# EAGLE design PCB_1layer (EAGLE 9.0.1)
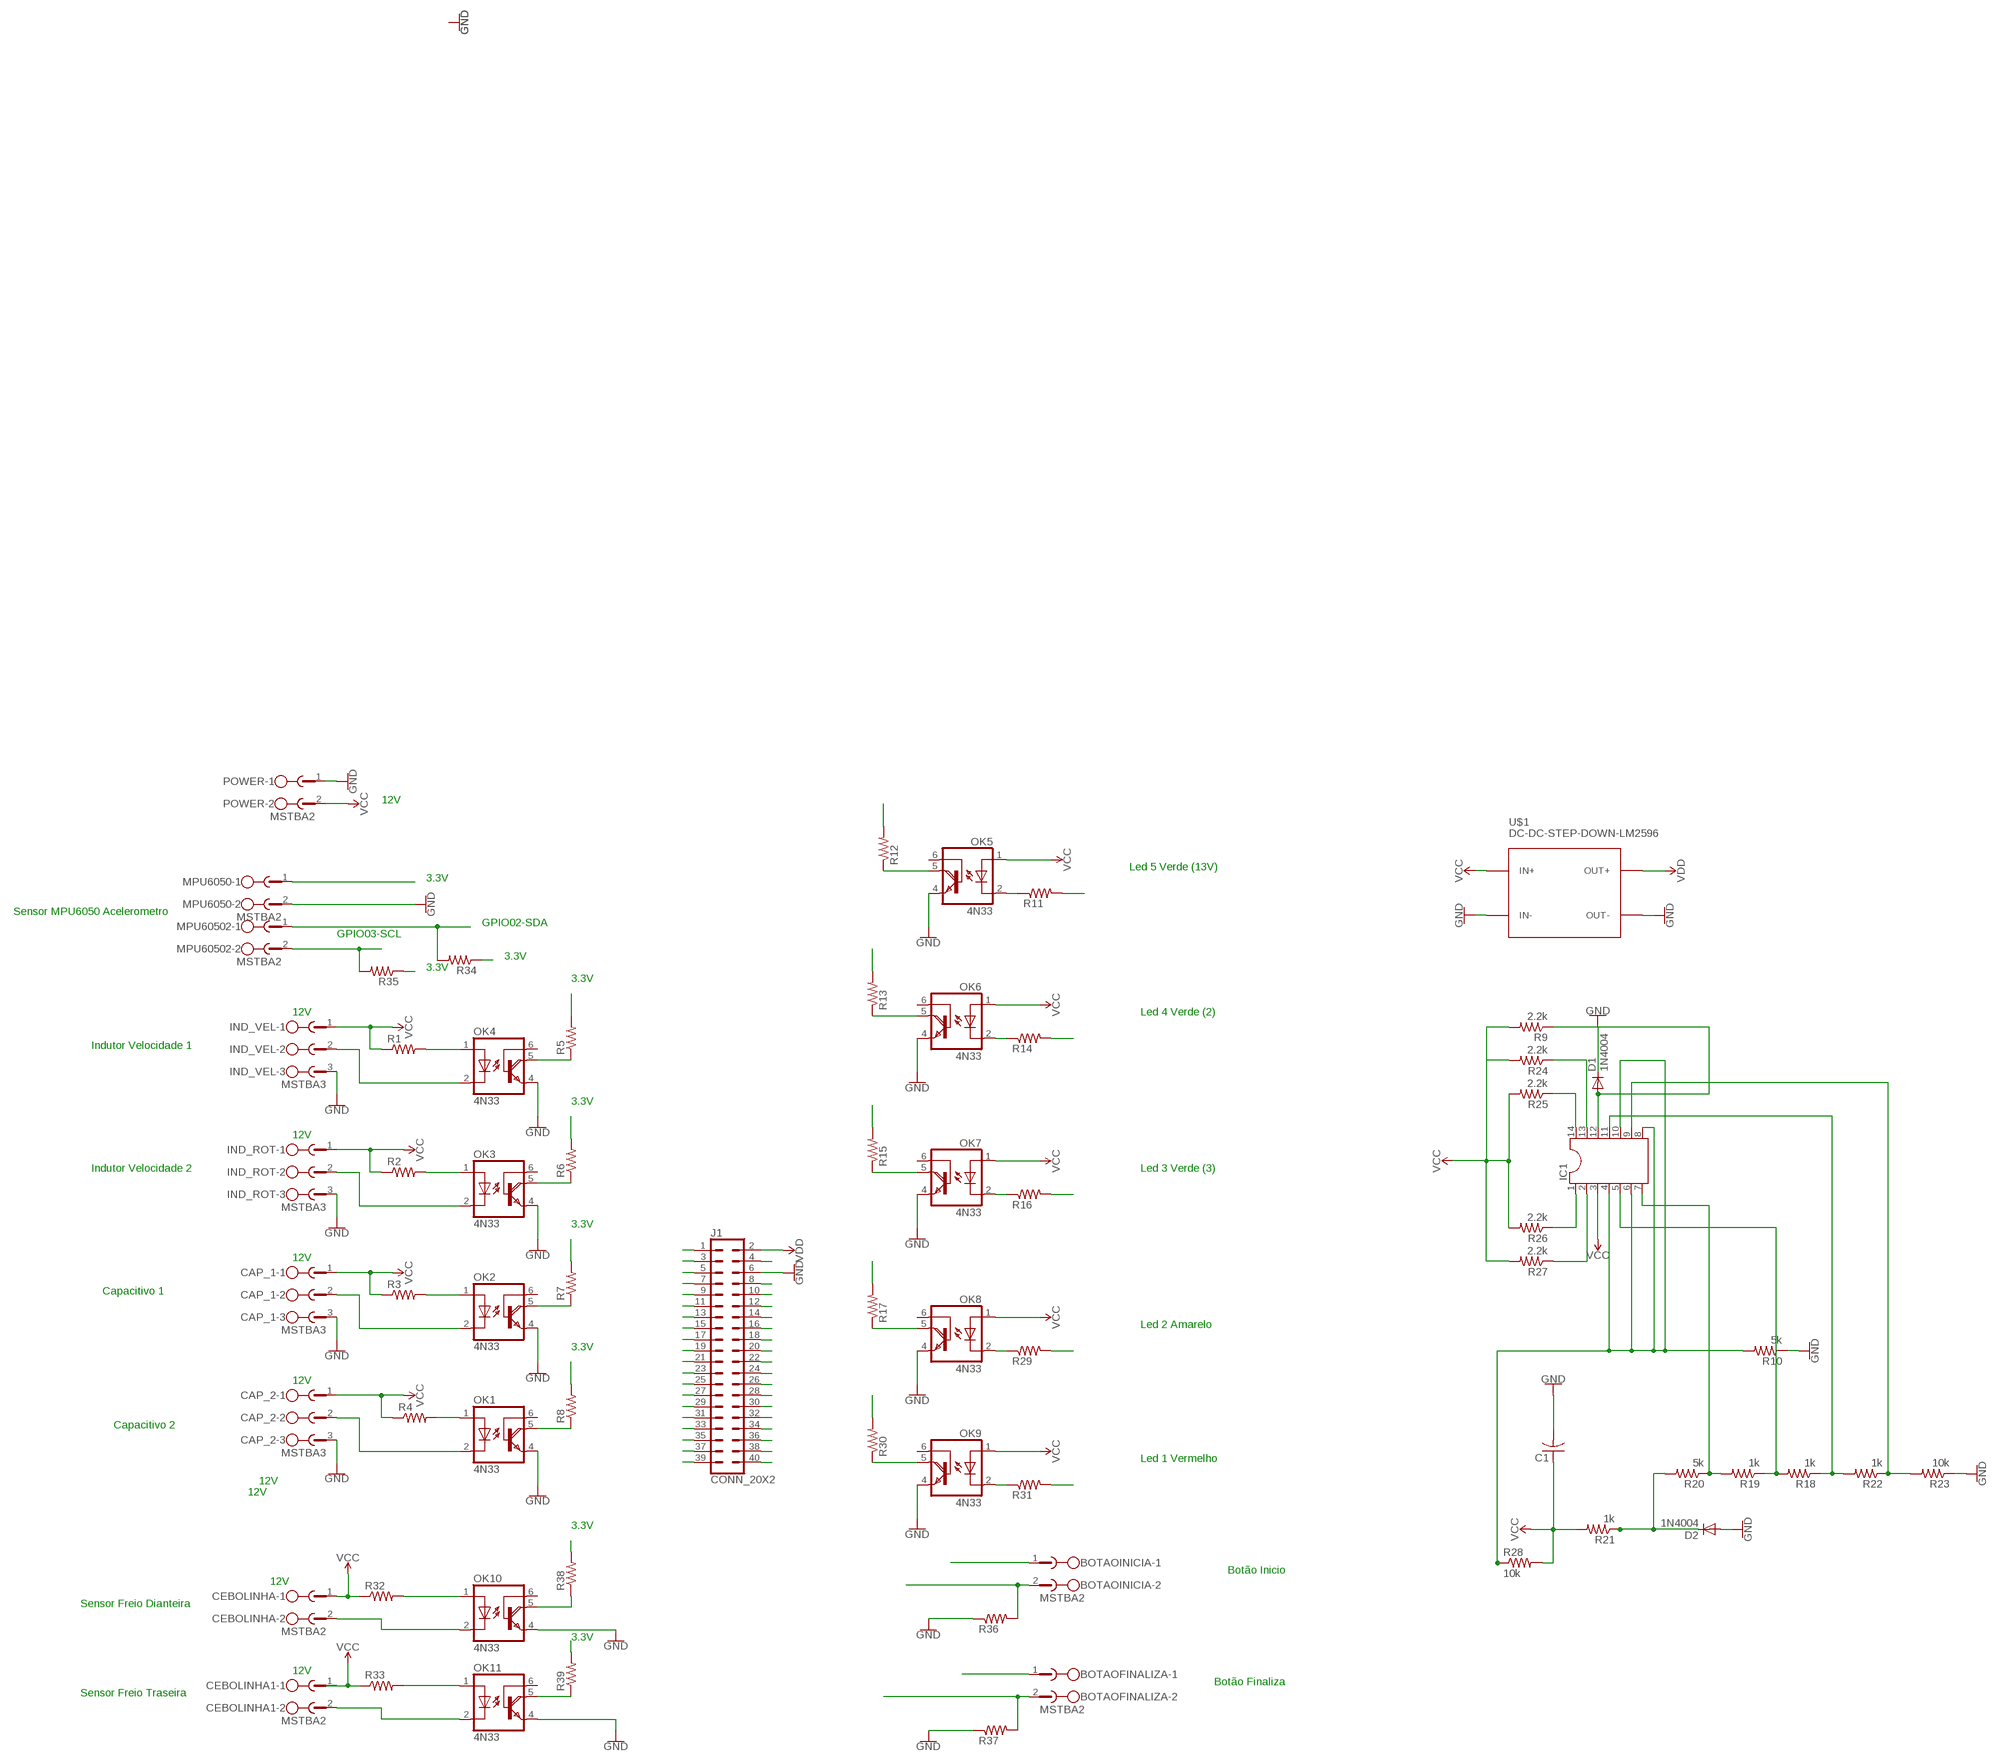
[diagram p0: schematic, sheet 1]

## Parts
BOTAOFINALIZA  MSTBA2  [MSTBA2]
BOTAOINICIA  MSTBA2  [MSTBA2]
C1  C-US025-050X050  [C025-050X050]
CAP_1  MSTBA3  [MSTBA3]
CAP_2  MSTBA3  [MSTBA3]
CEBOLINHA  MSTBA2  [MSTBA2]
CEBOLINHA1  MSTBA2  [MSTBA2]
D1  1N4004  [DO41-10]
D2  1N4004  [DO41-10]
IC1  DIL14  [DIL14]
IND_ROT  MSTBA3  [MSTBA3]
IND_VEL  MSTBA3  [MSTBA3]
J1  CONN_20X2  [2X20]
MPU6050  MSTBA2  [MSTBA2]
MPU60502  MSTBA2  [MSTBA2]
OK1  4N33  [DIL06]
OK2  4N33  [DIL06]
OK3  4N33  [DIL06]
OK4  4N33  [DIL06]
OK5  4N33  [DIL06]
OK6  4N33  [DIL06]
OK7  4N33  [DIL06]
OK8  4N33  [DIL06]
OK9  4N33  [DIL06]
OK10  4N33  [DIL06]
OK11  4N33  [DIL06]
POWER  MSTBA2  [MSTBA2]
R1  R-US_0204/7  [0204/7]
R2  R-US_0204/7  [0204/7]
R3  R-US_0204/7  [0204/7]
R4  R-US_0204/7  [0204/7]
R5  R-US_0204/7  [0204/7]
R6  R-US_0204/7  [0204/7]
R7  R-US_0204/7  [0204/7]
R8  R-US_0204/7  [0204/7]
R9  2.2k  R-US_0207/10  [0207/10]
R10  5k  R-US_0207/10  [0207/10]
R11  R-US_0204/7  [0204/7]
R12  R-US_0204/7  [0204/7]
R13  R-US_0204/7  [0204/7]
R14  R-US_0204/7  [0204/7]
R15  R-US_0204/7  [0204/7]
R16  R-US_0204/7  [0204/7]
R17  R-US_0204/7  [0204/7]
R18  1k  R-US_0207/10  [0207/10]
R19  1k  R-US_0207/10  [0207/10]
R20  5k  R-US_0207/10  [0207/10]
R21  1k  R-US_0207/10  [0207/10]
R22  1k  R-US_0207/10  [0207/10]
R23  10k  R-US_0207/10  [0207/10]
R24  2.2k  R-US_0207/10  [0207/10]
R25  2.2k  R-US_0207/10  [0207/10]
R26  2.2k  R-US_0207/10  [0207/10]
R27  2.2k  R-US_0207/10  [0207/10]
R28  10k  R-US_0207/10  [0207/10]
R29  R-US_0204/7  [0204/7]
R30  R-US_0204/7  [0204/7]
R31  R-US_0204/7  [0204/7]
R32  R-US_0204/7  [0204/7]
R33  R-US_0204/7  [0204/7]
R34  R-US_0204/7  [0204/7]
R35  R-US_0204/7  [0204/7]
R36  R-US_0204/7  [0204/7]
R37  R-US_0204/7  [0204/7]
R38  R-US_0204/7  [0204/7]
R39  R-US_0204/7  [0204/7]
U$1  DC-DC-STEP-DOWN-LM2596  [DC-DC-STEP-DOWN-LM2596]

## Nets
DC3.3V: BOTAOFINALIZA.1 BOTAOINICIA.1 J1.1 J1.17 MPU6050.1 R5.2 R6.2 R7.2 R8.2 R12.2 R13.2 R15.2 R17.2 R30.2 R34.1 R35.1 R38.2 R39.2
GND: C1.2 CAP_1.3 CAP_2.3 D1.C D2.A IND_ROT.3 IND_VEL.3 J1.6 J1.9 J1.14 J1.20 J1.25 J1.30 J1.34 OK1.4(E) OK2.4(E) OK3.4(E) OK4.4(E) OK5.4(E) OK6.4(E) OK7.4(E) OK8.4(E) OK9.4(E) OK10.4(E) OK11.4(E) POWER.1 R10.1 R23.1 R36.1 R37.1 U$1.IN- U$1.OUT-
GPIO01: CEBOLINHA1.2 OK11.2(C)
GPIO02: J1.3
GPIO2: MPU60502.2 R35.2
GPIO03: J1.5 MPU60502.1 R34.2
GPIO04: J1.7 OK4.5(COL) R5.1
GPIO05: J1.29
GPIO06: J1.31
GPIO07: J1.26
GPIO08: J1.24
GPIO09: J1.21
GPIO10: J1.19 OK1.5(COL) R8.1
GPIO11: CEBOLINHA.2 J1.23 OK10.2(C)
GPIO12: J1.32
GPIO13: J1.33
GPIO14: J1.8 OK5.5(COL) R12.1
GPIO15: J1.10 OK6.5(COL) R13.1
GPIO16: BOTAOINICIA.2 J1.36 R36.2
GPIO17: J1.11 OK3.5(COL) R6.1
GPIO18: J1.12 OK7.5(COL) R15.1
GPIO19: J1.35 OK10.5(COL) R38.1
GPIO20: BOTAOFINALIZA.2 J1.38 R37.2
GPIO21: J1.40
GPIO22: J1.15 OK2.5(COL) R7.1
GPIO23: J1.16 OK8.5(COL) R17.1
GPIO24: J1.18 OK9.5(COL) R30.1
GPIO25: J1.22
GPIO26: J1.37 OK11.5(COL) R39.1
GPIO27: J1.13
ID_SC: J1.28
ID_SD: J1.27
LM339P1: IC1.1 R11.2 R26.1
LM339P2: IC1.2 R14.2 R27.1
LM339P12: R31.2
LM339P13: IC1.13 R16.2 R24.1
LM339P14: IC1.14 R25.1 R29.2
LM33912: D1.A IC1.12 R9.1
N$1: IND_ROT.2 OK3.2(C)
N$2: CAP_2.2 OK1.2(C)
N$3: CAP_1.2 OK2.2(C)
N$4: OK3.1(A) R2.2
N$5: OK2.1(A) R3.2
N$6: OK1.1(A) R4.2
N$7: OK4.1(A) R1.2
N$8: IND_VEL.2 OK4.2(C)
N$13: D2.C R20.2 R21.1
N$14: IC1.9 R22.1 R23.2
N$15: IC1.4 IC1.6 IC1.8 IC1.10 R10.2 R28.1
N$16: IC1.5 R18.2 R19.1
N$17: IC1.11 R18.1 R22.2
N$18: IC1.7 R19.2 R20.1
N$22: J1.39
N$24: OK5.2(C) R11.1
N$27: OK6.2(C) R14.1
N$28: OK10.1(A) R32.2
N$29: OK7.2(C) R16.1
N$31: OK8.2(C) R29.1
N$33: OK9.2(C) R31.1
N$34: OK11.1(A) R33.2
VCC: C1.1 CAP_1.1 CAP_2.1 CEBOLINHA1.1 CEBOLINHA.1 IC1.3 IND_ROT.1 IND_VEL.1 OK5.1(A) OK6.1(A) OK7.1(A) OK8.1(A) OK9.1(A) POWER.2 R1.1 R2.1 R3.1 R4.1 R9.2 R21.2 R24.2 R25.2 R26.2 R27.2 R28.2 R32.1 R33.1 U$1.IN+
VDD: J1.2 J1.4 U$1.OUT+
Unconnected: MPU6050.2 OK1.6(B) OK2.6(B) OK3.6(B) OK4.6(B) OK5.6(B) OK6.6(B) OK7.6(B) OK8.6(B) OK9.6(B) OK10.6(B) OK11.6(B)

## Notes on the sheet
- 12V
- Led 5 Verde (13V)
- 3.3V
- Sensor MPU6050 Acelerometro
- GPIO02-SDA
- GPIO03-SCL
- 3.3V
- 3.3V
- 3.3V
- 12V | Led 4 Verde (2)
- Indutor Velocidade 1
- 3.3V
- 12V
- Indutor Velocidade 2 | Led 3 Verde (3)
- 3.3V
- 12V
- Capacitivo 1
- Led 2 Amarelo
- 3.3V
- 12V
- Capacitivo 2
- Led 1 Vermelho
- 12V
- 12V
- 3.3V
- Botão Inicio
- 12V
- Sensor Freio Dianteira
- 3.3V
- 12V
- Botão Finaliza
- Sensor Freio Traseira

## Library data of the parts
BOTAOFINALIZA BOTAOINICIA CEBOLINHA CEBOLINHA1 MPU6050 MPU60502 POWER = con-phoenix-508:MSTBA2: PHOENIX; MF: FARNELL; MPN: 1757242; OC_FARNELL: 3705171; OC_NEWARK: 71C4161
C1 = adafruit:C-US: CAPACITOR, American symbol
CAP_1 CAP_2 IND_ROT IND_VEL = con-phoenix-508:MSTBA3: PHOENIX; MF: FARNELL; MPN: 1757255; OC_FARNELL: 3705183; OC_NEWARK: 71C4162
D1 D2 = adafruit:1N4004: DIODE General purpose 1N400x type rectifier (With bigger pads) http://www.ladyada.net/library/pcb/eaglelibrary.html
IC1 = ic-package:DIL14: Dual In Line / Socket
J1 = SparkFun-Connectors:CONN_20X2: Multi connection point. Often used as Generic Header-pin footprint for 0.1 inch spaced/style header connections On any of the 0.1 inch spaced packages, you can populate with these: Break Away Headers - Straight <https://www.sparkfun.com/products/116> (PRT-00116) Break Away Male Headers - Right Angle <https://www.sparkfun.com/products/553> (PRT-00553) Female Headers <https://www.sparkfun.com/products/115> (PRT-00115) Break Away Headers - Machine Pin <https://www.sparkfun.com/products/117> (PRT-00117) Break Away Female Headers - Swiss Machine Pin <https://www.sparkfun.com/products/743> (PRT-00743)
OK1-OK11 = optocoupler:4N33: MOTOROLA OPTO COUPLER; MF: VISHAY/TELEFUNKEN; MPN: 4N33; OC_FARNELL: 1469601; OC_NEWARK: 88K1390
R1-R8 R11-R17 R29-R39 = rcl:R-US_: RESISTOR, American symbol
R9 R10 R18-R28 = adafruit:R-US_: RESISTOR, American symbol
U$1 = diy-modules:DC-DC-STEP-DOWN-LM2596: DC/DC Step-Down Regulator based on LM2596-ADJ chip LM2596 datasheet available here: http://www.ti.com/lit/ds/symlink/lm2596.pdf Click here to find device on ebay.com <http://www.ebay.com/sch/lm2596+power+regulator>

## Board
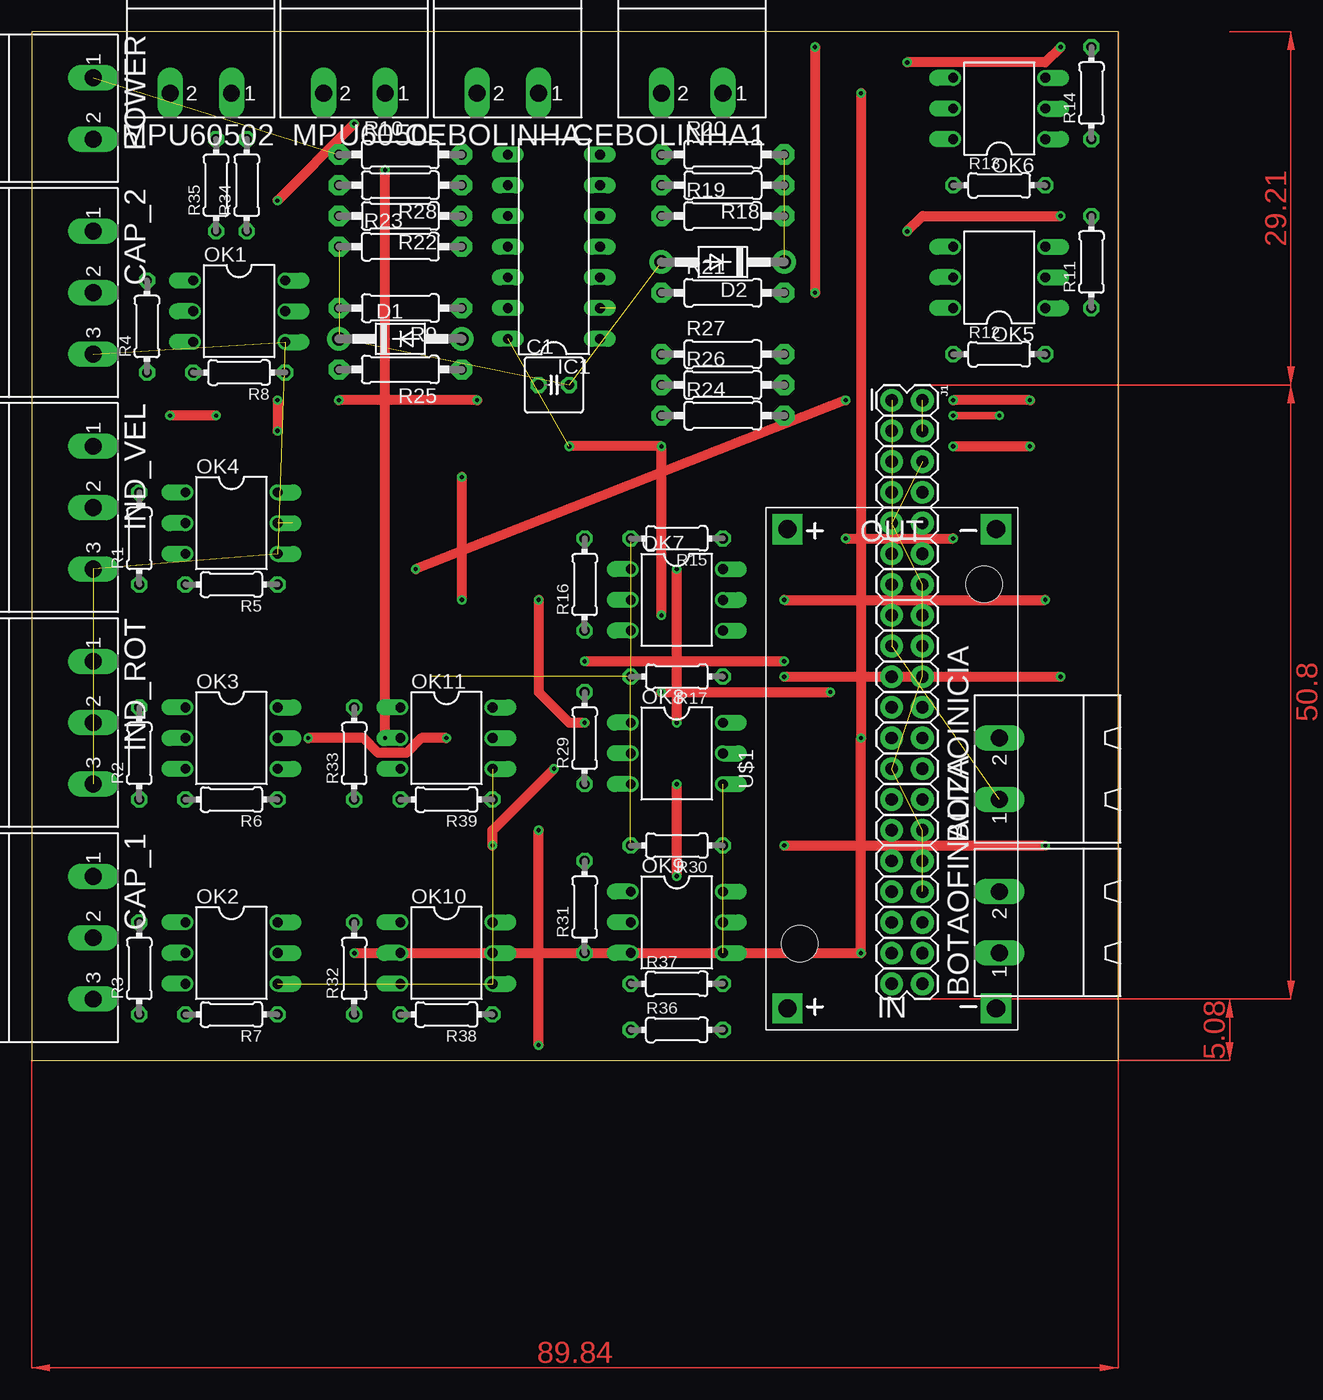
[diagram p1: board, top side]
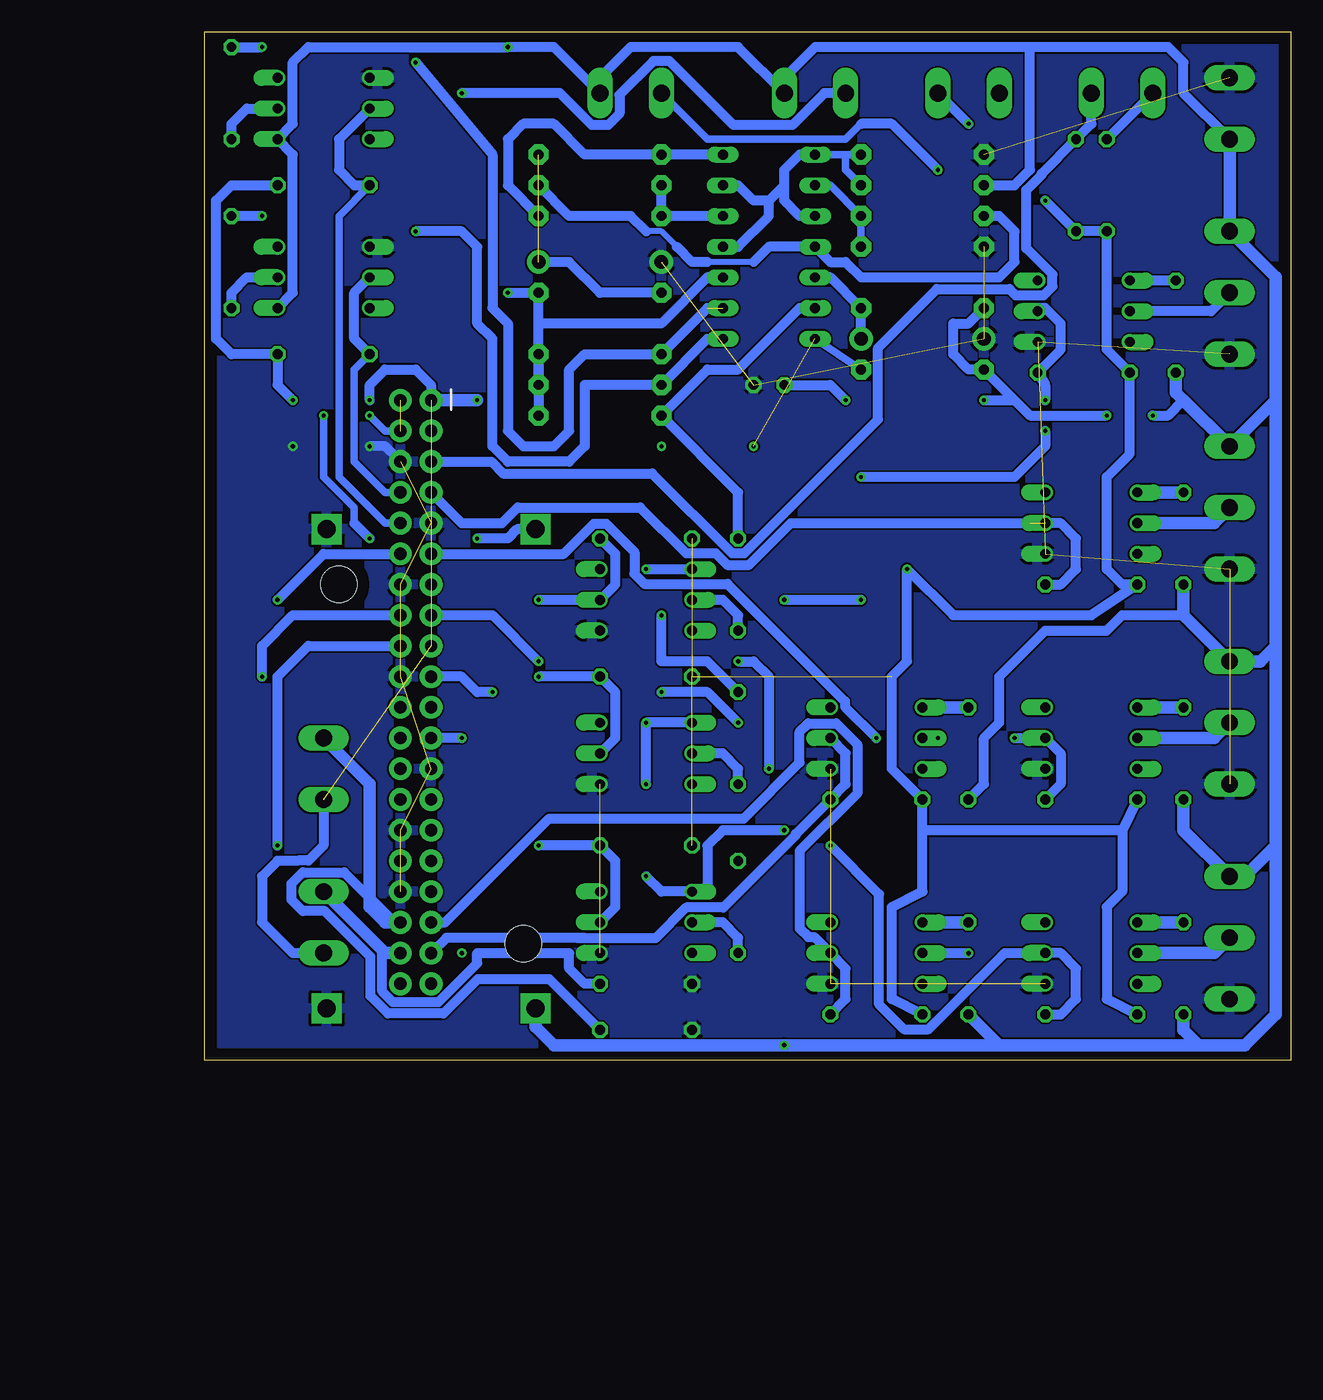
[diagram p2: board, bottom side, seen from below]

Size 89.84 x 85.08 mm. Coordinates in mm from the lower left corner, seen from the top.
Outline: 0,0 89.84,0 89.84,85.08 0,85.08 0,0
Copper layers (1*16): Top 0.035mm / dielectric 1.5mm / Bottom 0.035mm
Design rules "default": minimum track width 6mil, minimum drill 0.35mm, track to track 6mil, track to pad 6mil, pad to pad 6mil, via to via 6mil, smd to smd 6mil, copper to edge 40mil, drill to drill 6mil, minimum pad ring 10mil, minimum via ring 8mil, stop-mask expansion 4mil, vias tented up to drill 0mil, thermal gap 10mil

### Footprints (pad centres in the part's own frame; a part is rotated, then mirrored left to right if it is on the bottom)
MSTBA2 = drill 1.397 long: 1 -2.54,5.08; 2 2.54,5.08
C025-050X050 = drill 0.813 octagon: 1 -1.27,0; 2 1.27,0
MSTBA3 = drill 1.397 long: 1 -5.08,5.08; 2 0,5.08; 3 5.08,5.08
DO41-10 = drill 1.118 pad 1.93: A 5.08,0; C -5.08,0
DIL14 = drill 0.813 long: 1 -7.62,-3.81; 2 -5.08,-3.81; 3 -2.54,-3.81; 4 0,-3.81; 5 2.54,-3.81; 6 5.08,-3.81; 7 7.62,-3.81; 8 7.62,3.81; 9 5.08,3.81; 10 2.54,3.81; 11 0,3.81; 12 -2.54,3.81; 13 -5.08,3.81; 14 -7.62,3.81
2X20 = drill 1.016 pad 1.88: 1 0,0; 2 0,2.54; 3 2.54,0; 4 2.54,2.54; 5 5.08,0; 6 5.08,2.54; 7 7.62,0; 8 7.62,2.54; 9 10.16,0; 10 10.16,2.54; 11 12.7,0; 12 12.7,2.54; 13 15.24,0; 14 15.24,2.54; 15 17.78,0; 16 17.78,2.54; 17 20.32,0; 18 20.32,2.54; 19 22.86,0; 20 22.86,2.54; 21 25.4,0; 22 25.4,2.54; 23 27.94,0; 24 27.94,2.54; 25 30.48,0; 26 30.48,2.54; 27 33.02,0; 28 33.02,2.54; 29 35.56,0; 30 35.56,2.54; 31 38.1,0; 32 38.1,2.54; 33 40.64,0; 34 40.64,2.54; 35 43.18,0; 36 43.18,2.54; 37 45.72,0; 38 45.72,2.54; 39 48.26,0; 40 48.26,2.54
DIL06 = drill 0.813 offset: 1 -2.54,-3.81; 2 0,-3.81; 3 2.54,-3.81; 4 2.54,3.81; 5 0,3.81; 6 -2.54,3.81
0204/7 = drill 0.813 octagon: 1 -3.81,0; 2 3.81,0
0207/10 = drill 0.813 pad 1.676 octagon: 1 -5.08,0; 2 5.08,0
DC-DC-STEP-DOWN-LM2596 = drill 1.5 pad 2.5 square: IN+ -19.812,8.636; IN- -19.812,-8.636; OUT+ 19.812,8.636; OUT- 19.812,-8.636 | hole 3: -14.478,7.62; 15.24,-7.62

### Placement (x,y rotation side)
BOTAOFINALIZA  85.09,11.43 90 top
BOTAOINICIA  85.09,24.13 90 top
C1  43.18,55.88 0 top
CAP_1  0,10.16 270 top
CAP_2  0,63.5 270 top
CEBOLINHA  39.37,85.09 180 top
CEBOLINHA1  54.61,85.09 180 top
D1  30.48,59.69 0 top
D2  57.15,66.04 180 top
IC1  43.18,67.31 90 top
IND_ROT  0,27.94 270 top
IND_VEL  0,45.72 270 top
J1  71.12,54.61 270 top
MPU6050  26.67,85.09 180 top
MPU60502  13.97,85.09 180 top
OK1  17.15,61.98 270 top
OK2  16.51,8.89 270 top
OK3  16.51,26.67 270 top
OK4  16.51,44.45 270 top
OK5  80.01,64.77 90 top
OK6  80.01,78.74 90 top
OK7  53.34,38.1 270 top
OK8  53.34,25.4 270 top
OK9  53.34,11.43 270 top
OK10  34.29,8.89 270 top
OK11  34.29,26.67 270 top
POWER  0,78.74 270 top
R1  8.89,43.18 90 top
R2  8.89,25.4 90 top
R3  8.89,7.62 90 top
R4  9.53,60.71 90 top
R5  16.51,39.37 180 top
R6  16.51,21.59 180 top
R7  16.51,3.81 180 top
R8  17.15,56.9 180 top
R9  30.48,62.23 180 top
R10  30.48,74.93 0 top
R11  87.63,66.04 90 top
R12  80.01,58.42 0 top
R13  80.01,72.39 0 top
R14  87.63,80.01 90 top
R15  53.34,43.18 180 top
R16  45.72,39.37 90 top
R17  53.34,31.75 180 top
R18  57.15,72.39 180 top
R19  57.15,69.85 0 top
R20  57.15,74.93 0 top
R21  57.15,63.5 0 top
R22  30.48,69.85 180 top
R23  30.48,67.31 0 top
R24  57.15,53.34 0 top
R25  30.48,57.15 180 top
R26  57.15,55.88 0 top
R27  57.15,58.42 0 top
R28  30.48,72.39 180 top
R29  45.72,26.67 90 top
R30  53.34,17.78 180 top
R31  45.72,12.7 90 top
R32  26.67,7.62 90 top
R33  26.67,25.4 90 top
R34  17.78,72.39 90 top
R35  15.24,72.39 90 top
R36  53.34,2.54 0 top
R37  53.34,6.35 0 top
R38  34.29,3.81 180 top
R39  34.29,21.59 180 top
U$1  71.12,24.13 90 top

### Tracks (layer width: path | path; a pad name or v marks a point on that pad's centre or on a via)
DC3.3V  (via drill 0.35)  (5 unrouted)
  Top 0.813: v67.31,54.61 v31.75,40.64 | v82.55,54.61 v76.2,54.61 | v20.32,71.12 v26.67,77.47
  Bottom 0.813: R38.2 33.02,5.08 33.02,12.7 30.48,13.97 30.48,19.05 | 30.48,19.05 R39.2 33.02,24.13 33.02,31.75 31.75,33.02 v31.75,40.64 27.94,36.83 16.51,36.83 R5.2 13.97,39.37 15.24,40.64 15.24,48.26 13.34,50.17 R8.2 15.24,58.8 R35.1 R34.1 v20.32,71.12 | R6.2 13.97,19.05 | 13.97,19.05 30.48,19.05 | R7.2 15.24,5.08 15.24,12.7 13.97,13.97 13.97,19.05 | v82.55,54.61 83.82,55.88 R12.2 87.63,58.42 88.9,59.69 88.9,71.12 87.63,72.39 R13.2 | v76.2,54.61 76.2,55.88 74.93,57.15 72.39,57.15 71.12,55.88 J1.1 | v26.67,77.47 MPU6050.1 | BOTAOINICIA.1 80.01,17.78 81.25,16.54 82.12,16.54 82.16,16.51 83.82,16.51 85.09,15.24 85.09,11.43 82.55,8.89 BOTAOFINALIZA.1
  Bottom 1.016: J1.1 v67.31,54.61
GND  (via drill 0.35)  (17 unrouted)
  Top 0.813: v76.2,50.8 v82.55,50.8
  Bottom 0.813: J1.6 74.93,50.8 v76.2,50.8
  pour Bottom: 0,88.9 -1.27,87.63 -1.27,-1.27 0,-2.54 90.17,-2.54 91.44,-1.27 91.44,86.36 88.9,88.9
GPIO01  (via drill 0.35)
  Top 0.813: v29.21,26.67 v29.21,73.66
  Bottom 0.61: 35.56,77.47 36.83,76.2 48.26,76.2 CEBOLINHA1.2
  Bottom 0.813: OK11.2 v29.21,26.67 | v29.21,73.66 33.02,77.47 35.56,77.47
GPIO2
  Bottom 0.813: R35.2 MPU60502.2
GPIO03
  Bottom 0.813: MPU60502.1 16.51,77.47 R34.2 20.62,73.36 20.62,73.26 21.9,71.99 21.9,67.18 19.74,65.02 19.74,64.01 20.45,63.3 22.78,63.3 23.29,63.81 29.29,63.81 34.16,58.93 34.16,53.01 45.22,41.96 46.23,41.96 52.83,48.56 65.17,48.56 66.14,49.53 J1.5
GPIO04  (1 unrouted)
  Bottom 0.813: R5.1 19.05,39.37 17.78,40.64 17.78,43.18 19.05,44.45 OK4.5 | J1.7 68.58,44.45 65.27,44.45 63.97,45.75 53.83,45.75 50.04,41.96 47.59,41.96 46.62,41 44.82,41 41.36,44.45 21.59,44.45
GPIO10  (via drill 0.35)
  Top 0.813: v20.32,54.61 v20.32,52.07 | v35.56,48.26 v35.56,38.1 | v41.91,38.1 41.91,30.48 44.45,27.94 v45.72,27.94 | v52.07,30.48 v66.04,30.48
  Bottom 0.813: 21.21,62.23 20.32,62.23 19.05,60.96 19.05,58.8 R8.1 20.32,55.88 v20.32,54.61 | 21.59,62.23 21.21,62.23 | 21.21,62.23 OK1.5 | v20.32,52.07 20.32,50.8 22.86,48.26 v35.56,48.26 | v35.56,38.1 v41.91,38.1 | v45.72,27.94 48.26,30.48 v52.07,30.48 | v66.04,30.48 67.31,30.48 68.58,31.75 J1.19
GPIO11  (via drill 0.35)
  Top 0.813: v68.58,80.01 v68.58,26.67 v68.58,8.89 v26.67,8.89
  Bottom 0.813: CEBOLINHA.2 38.59,80.01 41.25,77.36 46.1,77.36 51.41,82.66 52.74,82.66 55.54,79.86 55.54,78.3 56.49,77.36 57.82,77.36 60.47,80.01 v68.58,80.01 | v68.58,26.67 J1.23 | OK10.2 v26.67,8.89
GPIO14
  Bottom 0.61: J1.8 74.93,46.99 77.47,49.53 77.47,57.15 R12.1
  Bottom 0.813: R12.1 77.47,59.69 77.47,63.5 OK5.5
GPIO15
  Bottom 0.61: J1.10 74.93,44.45 78.74,48.26 78.74,69.85 R13.1
  Bottom 0.813: OK6.5 78.74,76.2 78.74,73.66 77.47,72.39 R13.1
GPIO16
  Bottom 0.813: R36.2 61.34,6.73 67.26,6.73 70.1,3.89 74.68,3.89 76.12,5.33 76.12,8.58 79.91,12.36 81.72,12.36 82.66,13.31 82.66,14.64 81.72,15.58 78.3,15.58 74.15,11.43 J1.36
  Bottom 1.016: BOTAOINICIA.2 76.2,22.86 76.2,12.7 74.93,11.43 J1.36
GPIO17  (via drill 0.35)
  Top 0.813: v34.29,26.67 32.2,26.67 30.99,25.45 28.65,25.45 27.44,26.67 v22.86,26.67
  Bottom 0.813: v34.29,26.67 36.88,29.26 36.88,29.72 46.59,39.42 53.49,39.42 54.31,40.24 54.31,42.06 56.65,44.4 57.66,44.4 60.14,41.91 J1.11 | v22.86,26.67 OK3.5 19.05,25.4 19.05,22.86 R6.1
GPIO18  (via drill 0.35)
  Top 0.813: v62.23,38.1 v83.82,38.1
  Bottom 0.813: v62.23,38.1 OK7.5 55.88,39.37 55.88,41.91 R15.1 | v83.82,38.1 80.01,41.91 J1.12
GPIO19
  Bottom 0.813: R38.1 36.83,5.08 36.83,7.62 OK10.5 39.42,10.21 39.93,10.21 40.64,10.92 40.64,17.33 35.87,22.1 35.87,26.16 37.6,27.89 39.93,27.89 40.64,27.17 40.64,24.64 45.26,20.02 61.36,20.02 69.95,11.43 J1.35
GPIO20
  Bottom 0.813: BOTAOFINALIZA.2 75.16,9.12 75.16,5.73 74.28,4.85 70.5,4.85 67.31,8.04 67.31,8.89 59.69,8.89 59.69,7.62 58.42,6.35 R37.2
  Bottom 1.016: J1.38 74.93,8.89 BOTAOFINALIZA.2
GPIO22  (via drill 0.35)
  Top 0.813: v62.23,33.02 v45.72,33.02 | v38.1,17.78 38.1,19.05 v43.18,24.13
  Bottom 0.813: R7.1 19.05,3.81 17.78,5.08 17.78,7.62 19.05,8.89 OK2.5 23.68,8.89 29.98,2.59 32.01,2.59 34.06,4.65 34.06,13.74 v38.1,17.78 | J1.15 66.04,36.83 v62.23,33.02 | v45.72,33.02 44.45,33.02 43.18,31.75 v43.18,24.13
GPIO23  (via drill 0.35)
  Top 0.813: v62.23,31.75 v85.09,31.75
  Bottom 0.813: OK8.5 55.88,26.67 55.88,30.48 R17.1 v62.23,31.75 | v85.09,31.75 85.09,34.29 82.55,36.83 J1.16
GPIO24  (via drill 0.35)
  Top 0.813: v62.23,17.78 v83.82,17.78
  Bottom 0.813: OK9.5 55.88,12.7 55.88,16.51 R30.1 v62.23,17.78 | v83.82,17.78 83.82,31.75 81.28,34.29 J1.18
GPIO26
  Bottom 0.813: OK11.5 36.83,25.4 36.83,22.86 R39.1 40.95,18.75 40.95,18.65 46.95,12.65 50.04,12.65 52.58,10.11 58.42,10.11 | 58.42,10.11 58.98,10.11 | 58.42,10.11 58.47,10.16 69.85,10.16 J1.37
LM339P1  (via drill 0.35)
  Top 0.813: v72.39,68.58 73.66,69.85 v85.09,69.85
  Bottom 0.813: IC1.1 48.26,59.69 R26.1 58.42,55.88 58.42,50.8 59.69,49.53 64.77,49.53 66.04,50.8 66.04,59.69 67.31,60.96 67.31,67.31 68.58,68.58 v72.39,68.58 | v85.09,69.85 R11.2
LM339P2  (via drill 0.35)  (1 unrouted)
  Top 0.813: v85.09,83.82 83.82,82.55 v72.39,82.55
  Bottom 0.813: 48.26,62.23 R27.1 58.42,58.42 59.69,57.15 59.69,52.07 60.96,50.8 63.5,50.8 64.77,52.07 64.77,60.96 66.04,62.23 66.04,74.93 v72.39,82.55 | R14.2 v85.09,83.82
LM339P13
  Bottom 0.813: IC1.13 40.64,62.23 45.72,57.15 48.26,57.15 R24.1 45.72,46.99 R16.2
LM339P14  (via drill 0.35)  (1 unrouted)
  Top 0.813: v52.07,36.83 v52.07,50.8 v44.45,50.8
  Bottom 0.61: R25.1 IC1.14
  Bottom 0.813: R29.2 48.26,33.02 52.07,33.02 v52.07,36.83
LM33912
  Bottom 0.813: IC1.12 38.1,64.77 R9.1 D1.A
N$1
  Bottom 1.016: IND_ROT.2 6.35,26.67 OK3.2
N$2
  Bottom 0.813: OK1.2 6.6,61.98 CAP_2.2
N$3
  Bottom 1.016: CAP_1.2 6.35,8.89 OK2.2
N$4
  Bottom 1.016: R2.2 OK3.1
N$5
  Bottom 1.016: R3.2 OK2.1
N$6
  Bottom 0.813: R4.2 OK1.1
N$7
  Bottom 1.016: R1.2 OK4.1
N$8
  Bottom 1.016: IND_VEL.2 6.35,44.45 OK4.2
N$13  (1 unrouted)
  Bottom 0.813: R21.1 57.15,63.5 59.69,66.04 D2.C
N$14
  Bottom 0.61: IC1.9 38.1,72.39 R22.1 R23.2
N$15
  Bottom 0.61: R10.2 36.83,74.93 | 36.83,74.93 IC1.8 | R28.1 36.83,73.66 36.83,74.93
  Bottom 0.813: IC1.10 40.64,69.85 41.91,71.12 41.91,72.39 | IC1.8 40.64,74.93 41.91,73.66 41.91,72.39 | IC1.4 45.72,67.31 43.18,69.85 43.18,71.12 | 43.18,71.12 41.91,72.39 | 43.18,71.12 44.45,71.12 45.72,72.39 IC1.6
N$16
  Bottom 0.813: IC1.5 R19.1 R18.2
N$17
  Bottom 0.508: 44.45,66.04 48.26,66.04 | 50.8,67.31 52.07,68.58 53.34,68.58
  Bottom 0.813: R22.2 24.13,69.85 22.86,68.58 22.86,66.04 24.13,64.77 35.56,64.77 36.83,66.04 38.1,66.04 IC1.11 43.18,67.31 44.45,66.04 | 48.26,66.04 49.53,66.04 50.8,67.31 | 53.34,68.58 54.61,69.85 59.69,69.85 R18.1
N$18
  Bottom 0.813: IC1.7 R20.1 58.42,74.93 60.96,77.47 63.5,77.47 64.77,76.2 64.77,72.39 R19.2
N$24
  Bottom 0.813: R11.1 87.63,63.5 86.36,64.77 OK5.2
N$27
  Bottom 0.813: R14.1 87.63,77.47 86.36,78.74 OK6.2
N$28
  Bottom 1.016: R32.2 OK10.1
N$29
  Bottom 0.813: R16.1 45.72,36.83 46.99,38.1 OK7.2
N$31
  Bottom 0.813: R29.1 45.72,24.13 46.99,25.4 OK8.2
N$33
  Bottom 0.813: R31.1 45.72,10.16 46.99,11.43 OK9.2
N$34
  Bottom 1.016: R33.2 OK11.1
VCC  (via drill 0.35)
  Top 0.813: v53.34,15.24 v53.34,22.86 | v53.34,27.94 v53.34,40.64 | v64.77,83.82 v64.77,63.5 | v41.91,1.27 v41.91,19.05 | v15.24,53.34 v11.43,53.34 | v36.83,54.61 v25.4,54.61
  Bottom 0.813: v53.34,22.86 v53.34,27.94 OK8.1 | v53.34,40.64 OK7.1 | v53.34,15.24 52.07,13.97 OK9.1 48.26,13.97 48.26,17.78 46.99,19.05 v41.91,19.05 | POWER.2 8.89,80.01 8.89,82.55 10.16,83.82 21.59,83.82 | 21.59,83.82 39.37,83.82 41.91,81.28 CEBOLINHA.1 45.72,83.82 54.61,83.82 57.15,81.28 CEBOLINHA1.1 60.96,83.82 v64.77,83.82 81.28,83.82 82.55,82.55 82.55,77.47 OK6.1 82.55,74.93 82.55,63.5 OK5.1 | R27.2 R24.2 R26.2 R27.2 | R27.2 62.23,60.96 | 62.23,60.96 R21.2 v64.77,63.5 | R28.2 22.86,72.39 21.59,73.66 21.59,83.82 | IC1.3 48.26,64.77 52.07,60.96 62.23,60.96 | R33.1 25.4,22.86 25.4,26.67 24.13,27.94 24.13,31.75 20.32,35.56 15.24,35.56 13.97,36.83 8.89,36.83 | 22.86,54.61 R25.2 26.67,57.15 27.94,58.42 27.94,60.96 26.67,60.96 R9.2 | 22.86,54.61 21.59,53.34 v15.24,53.34 | v11.43,53.34 10.16,53.34 8.89,54.61 | C1.1 38.1,55.88 v36.83,54.61 | v25.4,54.61 22.86,54.61
  Bottom 1.016: POWER.2 CAP_2.1 1.27,64.77 1.27,54.61 | 1.27,54.61 IND_VEL.1 8.89,54.61 9.53,55.25 R4.1 | 1.27,34.29 2.54,33.02 IND_ROT.1 8.89,36.83 R1.1 | 1.27,34.29 1.27,54.61 | 1.27,17.78 3.81,15.24 CAP_1.1 8.89,19.05 R2.1 | 1.27,17.78 1.27,34.29 | 1.27,17.78 1.27,3.81 3.81,1.27 7.62,1.27 | 7.62,1.27 8.89,2.54 R3.1 | 7.62,1.27 24.13,1.27 | 24.13,1.27 R32.1 | U$1.IN+ 62.48,2.79 60.96,1.27 v41.91,1.27 24.13,1.27
  other vias: 41.91,55.88
VDD  (via drill 0.35)  (1 unrouted)
  Top 0.61: v80.01,53.34 v76.2,53.34
  Top 0.813: v67.31,43.18 v76.2,43.18
  Bottom 0.61: 77.47,44.45 77.47,45.72 80.01,48.26 v80.01,53.34 | v76.2,53.34 74.93,52.07 J1.4
  Bottom 0.813: U$1.OUT+ 64.01,43.94 64.77,43.18 v67.31,43.18 | v76.2,43.18 77.47,44.45
(copper drawn outside any net)
  shapes: Top area x5